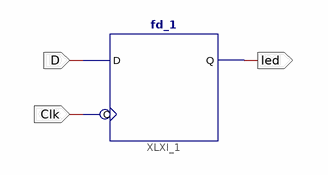
[diagram p0: schematic sheet 1]
// Xilinx ISE schematic Test.sch (spartan3e) as structural Verilog: 1 symbols, 3 ports
module Test (
  input  D,
  input  Clk,
  output led
);

  fd_1 XLXI_1 (.C(Clk), .D(D), .Q(led));
endmodule
